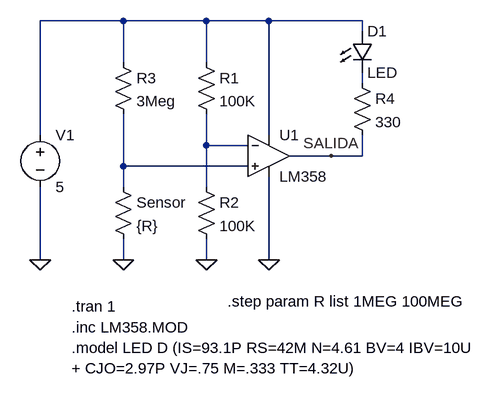
[diagram p0: schematic sensor-tactil.asc]
sensor-tactil.asc, the LTspice schematic file:
Version 4
SHEET 1 880 680
WIRE 80 -48 -48 -48
WIRE 208 -48 80 -48
WIRE 304 -48 208 -48
WIRE 448 -48 304 -48
WIRE 448 -32 448 -48
WIRE 80 16 80 -48
WIRE 208 16 208 -48
WIRE 448 48 448 32
WIRE -48 128 -48 -48
WIRE 304 128 304 -48
WIRE 208 144 208 96
WIRE 272 144 208 144
WIRE 400 160 336 160
WIRE 448 160 448 128
WIRE 448 160 400 160
WIRE 80 176 80 96
WIRE 272 176 80 176
WIRE 80 208 80 176
WIRE 208 208 208 144
WIRE -48 320 -48 208
WIRE 80 320 80 288
WIRE 208 320 208 288
WIRE 304 320 304 192
FLAG 80 320 0
FLAG 208 320 0
FLAG 304 320 0
FLAG -48 320 0
FLAG 400 160 SALIDA
SYMBOL Opamps\\opamp2 304 96 R0
SYMATTR InstName U1
SYMATTR Value LM358
SYMBOL voltage -48 112 R0
WINDOW 123 0 0 Left 0
WINDOW 39 0 0 Left 0
SYMATTR InstName V1
SYMATTR Value 5
SYMBOL res 192 0 R0
SYMATTR InstName R1
SYMATTR Value 100K
SYMBOL res 192 192 R0
SYMATTR InstName R2
SYMATTR Value 100K
SYMBOL res 64 0 R0
SYMATTR InstName R3
SYMATTR Value 3Meg
SYMBOL res 64 192 R0
SYMATTR InstName Sensor
SYMATTR Value {R}
SYMBOL res 432 32 R0
SYMATTR InstName R4
SYMATTR Value 330
SYMBOL LED 432 -32 R0
SYMATTR InstName D1
SYMATTR Value LED
TEXT 0 424 Left 2 !.inc LM358.MOD
TEXT 0 456 Left 2 !.model LED D (IS=93.1P RS=42M N=4.61 BV=4 IBV=10U\n+ CJO=2.97P VJ=.75 M=.333 TT=4.32U)
TEXT 240 384 Left 2 !.step param R list 1MEG 100MEG
TEXT 0 392 Left 2 !.tran 1

The netlist it stands for:
* sensor-tactil.asc
XU1 N004 N003 N001 0 SALIDA LM358  ; pins In+ In- V+ V- OUT
V1 N001 0 5
R1 N001 N003 100K
R2 N003 0 100K
R3 N001 N004 3Meg
R§Sensor N004 0 {R}
R4 N002 SALIDA 330
D1 N001 N002 LED
.model D D
.lib standard.dio
.inc LM358.MOD
.model LED D (IS=93.1P RS=42M N=4.61 BV=4 IBV=10U
+ CJO=2.97P VJ=.75 M=.333 TT=4.32U)
.step param R list 1MEG 100MEG
.tran 1
.backanno
.end